# Altium schematic sheet Driver.SchDoc: Driver: MOSFET logic-level low-side con diodo de rueda libre
size A4; Author: Efrain Alvarado; CompanyName: Universidad de Cuenca - MCIE; DrawnBy: Efrain Alvarado; DocumentNumber: E08-D; Revision: 1.0; SheetNumber: 1; SheetTotal: 1
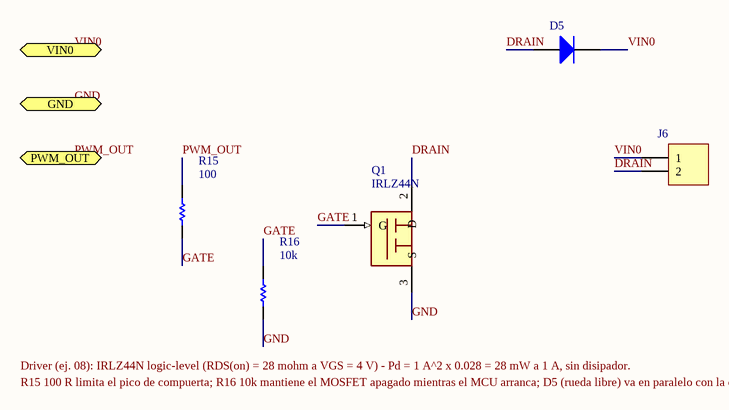
[diagram p0: Driver.SchDoc]

## Parts
D5  Diode 1N4007  [DO-41]  (value not drawn)
J6  Header 2  [HDR1X2]  (value not drawn)
Q1  IRLZ44N  [TO-220AB]
R15  value 100  [0603]  (hidden comment: Res1)
R16  value 10k  [0603]  (hidden comment: Res1)

## Ports
GND, PWM_OUT, VIN0

## Nets
DRAIN: D5.1(A) J6.2 Q1.2(D)
GATE: Q1.1(G) R15.1 R16.2
GND: Q1.3(S) R16.1 ; port GND
PWM_OUT: R15.2 ; port PWM_OUT
VIN0: D5.2(K) J6.1 ; port VIN0

## Notes on the sheet
- Driver (ej. 08): IRLZ44N logic-level (RDS(on) = 28 mohm a VGS = 4 V) - Pd = 1 A^2 x 0.028 = 28 mW a 1 A, sin disipador.
- R15 100 R limita el pico de compuerta; R16 10k mantiene el MOSFET apagado mientras el MCU arranca; D5 (rueda libre) va en paralelo con la carga.

## Library data of the parts
D5 = Diode 1N4007: Rueda libre en paralelo con la carga; Manufacturer: Diodes Inc.; Published: 8-Jun-2000; LatestRevisionDate: 17-Jul-2002; LatestRevisionNote: Re-released for DXP Platform.; DatasheetVersion: 1998; PackageVersion: Aug-1999; PackageReference: DO-41; Publisher: Altium Limited; PackageDescription: Diode, Axial; Body 5.2 x 2.7 mm (LxDia. max), Lead Dia. 0.86 mm (max); Code_JEDEC: DO-204-AL; ComponentLink1Description: Manufacturer Link; ComponentLink1URL: http://www.fairchildsemi.com/; ComponentLink2Description: Datasheet; ComponentLink2URL: http://www.fairchildsemi.com/ds/1N%2F1N4001.pdf; Manufacturer Part Number: 1N4007
J6 = Header 2: Carga externa: pin1 VIN, pin2 DRAIN; Manufacturer: Generic; Manufacturer Part Number: Pin header 1x2 / borne; LatestRevisionDate: 17-Jul-2002; LatestRevisionNote: Re-released for DXP Platform.; Publisher: Altium Limited
Q1 = IRLZ44N: N-MOSFET logic-level 55 V 47 A TO-220 (G,D,S); Manufacturer: Infineon; Manufacturer Part Number: IRLZ44NPBF
R15 = Res1: Resistor 100 0603; Manufacturer: Yageo; Manufacturer Part Number: RC0603FR-07100; Published: 8-Jun-2000; LatestRevisionDate: 17-Jul-2002; LatestRevisionNote: Re-released for DXP Platform.; PackageReference: AXIAL-0.3; Publisher: Altium Limited; PackageDescription: Axial Device, Thru-Hole; 2 Leads; 0.3 in Pin Spacing
R16 = Res1: Resistor 10k 0603; Manufacturer: Yageo; Manufacturer Part Number: RC0603FR-0710K; Published: 8-Jun-2000; LatestRevisionDate: 17-Jul-2002; LatestRevisionNote: Re-released for DXP Platform.; PackageReference: AXIAL-0.3; Publisher: Altium Limited; PackageDescription: Axial Device, Thru-Hole; 2 Leads; 0.3 in Pin Spacing